# Altium schematic sheet 4th driver.SchDoc
size A3
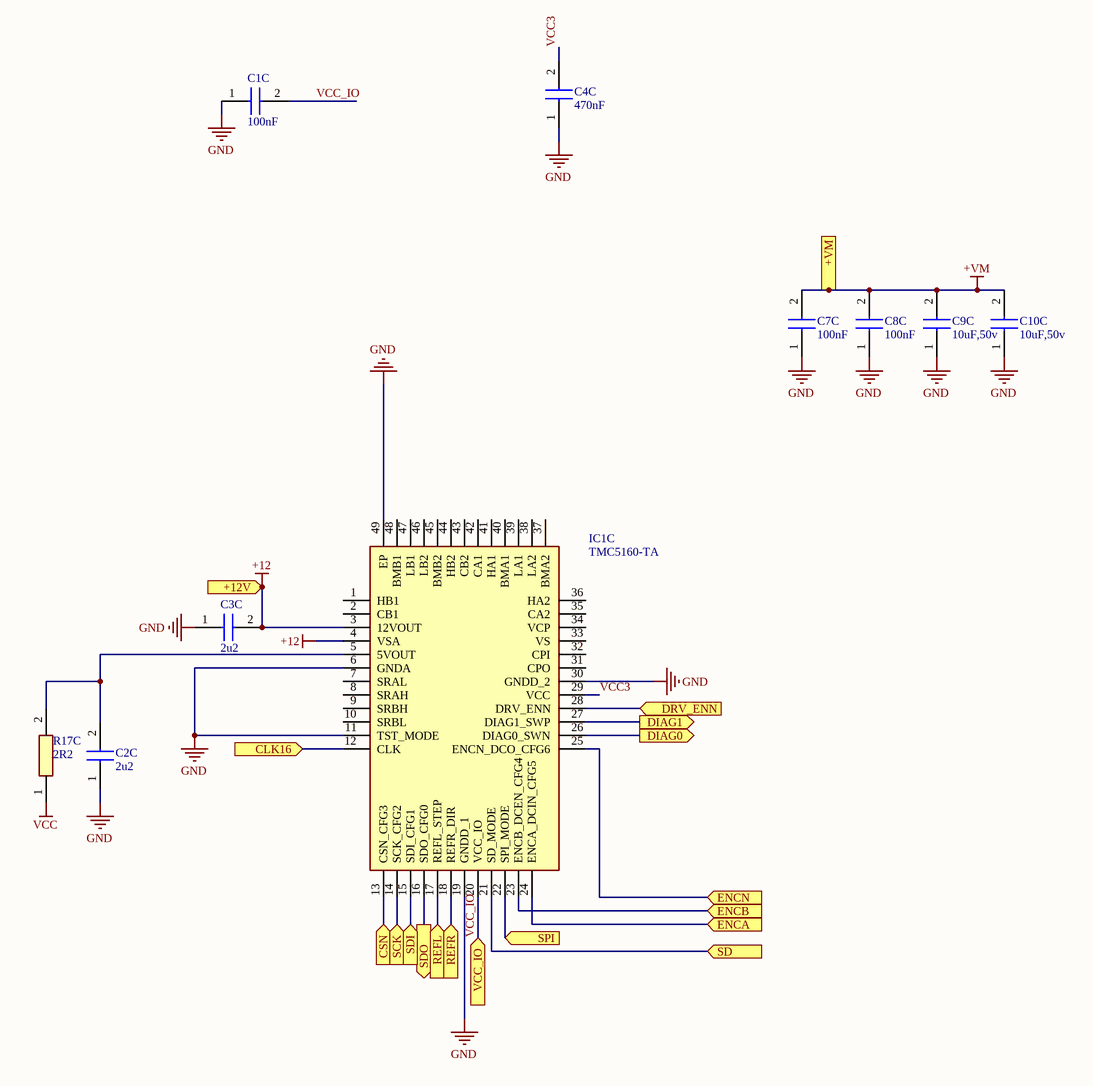
[diagram p0: 4th driver.SchDoc]

## Parts
C1C  100nF  [CAPC1608X90N]
C2C  2u2  [CAPC1608X90N]
C3C  2u2  [CAPC1608X90N]
C4C  470nF  [CAPC1608X90N]
C7C  100nF  [CAPC1608X90N]
C8C  100nF  [CAPC1608X90N]
C9C  10uF,50v  [CAPC3216X180N]
C10C  10uF,50v  [CAPC3216X180N]
IC1C  TMC5160-TA  [QFP50P900X900X120-49N]
R17C  2R2  [RESC1608X55N]

## Ports
+12V (in), +VM (in), CLK16 (in), CSN (in), DIAG0 (out), DIAG1 (out), DRV_ENN (in), ENCA (in), ENCB (in), ENCN (in), REFL (in), REFR (in), SCK (in), SD (in), SDI (in), SDO (out), SPI (in), VCC_IO (in)

## Nets
+12: C3C.2 IC1C.3(12VOUT) IC1C.4(VSA) ; port +12V
+VM: C7C.2 C8C.2 C9C.2 C10C.2 ; port +VM
GND: C1C.1 C2C.1 C3C.1 C4C.1 C7C.1 C8C.1 C9C.1 C10C.1 IC1C.6(GNDA) IC1C.11(TST_MODE) IC1C.19(GNDD_1) IC1C.30(GNDD_2) IC1C.49(EP)
VCC: R17C.1
CLK16: IC1C.12(CLK) ; port CLK16
CSN: IC1C.13(CSN_CFG3) ; port CSN
DIAG0: IC1C.26(DIAG0_SWN) ; port DIAG0
DIAG1: IC1C.27(DIAG1_SWP) ; port DIAG1
DRV_ENN: IC1C.28(DRV_ENN) ; port DRV_ENN
ENCA: IC1C.24(ENCA_DCIN_CFG5) ; port ENCA
ENCB: IC1C.23(ENCB_DCEN_CFG4) ; port ENCB
ENCN: IC1C.25(ENCN_DCO_CFG6) ; port ENCN
REFL: IC1C.17(REFL_STEP) ; port REFL
REFR: IC1C.18(REFR_DIR) ; port REFR
SCK: IC1C.14(SCK_CFG2) ; port SCK
SD: IC1C.21(SD_MODE) ; port SD
SDI: IC1C.15(SDI_CFG1) ; port SDI
SDO: IC1C.16(SDO_CFG0) ; port SDO
SPI: IC1C.22(SPI_MODE) ; port SPI
VCC3: C4C.2 IC1C.29(VCC)
VCC_IO: C1C.2 IC1C.20(VCC_IO) ; port VCC_IO
NetC2C_2: C2C.2 IC1C.5(5VOUT) R17C.2

Not connected (* = marked no-connect by the designer): IC1C 1(HB1) 2(CB1) 7(SRAL) 8(SRAH) 9(SRBH) 10(SRBL) 31(CPO) 32(CPI) 33(VS) 34(VCP) 35(CA2) 36(HA2) 37(BMA2) 38(LA2) 39(LA1) 40(BMA1) 41(HA1) 42(CA1) 43(CB2) 44(HB2) 45(BMB2) 46(LB2) 47(LB1) 48(BMB1)

## Library data of the parts
C1C C2C C3C C4C C7C C8C = GCM188R71H224KA64D: Capacitor; Manufacturer_Name: Murata Electronics; Datasheet Link: https://psearch.en.murata.com/capacitor/product/GCM188R71H224KA64%23.html; Height: 0.9mm; Manufacturer_Part_Number: GCM188R71H224KA64D; Mouser Part Number: 81-GCM188R71H224K64D; Mouser Price/Stock: https://www.mouser.co.uk/ProductDetail/Murata-Electronics/GCM188R71H224KA64D?qs=Kk8YaIHLBVBgtUYYs%2FZrtQ%3D%3D; Arrow Part Number: GCM188R71H224KA64D; Arrow Price/Stock: https://www.arrow.com/en/products/gcm188r71h224ka64d/murata-manufacturing
  C1C C7C C8C: LCSC Part #: C161181
  C2C: LCSC Part #: C77047
  C3C: LCSC Part #: *
  C4C: LCSC Part #: C170149
C9C C10C = GRM31CR61H106MA12L: Capacitor; Manufacturer_Name: Murata Electronics; Datasheet Link: https://datasheet.datasheetarchive.com/originals/distributors/DKDS-10/192395.pdf; Height: 1.8mm; Manufacturer_Part_Number: GRM31CR61H106MA12L; Mouser Part Number: 81-GRM31CR61H106MA2L; Mouser Price/Stock: https://www.mouser.co.uk/ProductDetail/Murata-Electronics/GRM31CR61H106MA12L/?qs=eeBpzGFlv%252B9KISFXBDHybg%3D%3D; Arrow Part Number: GRM31CR61H106MA12L; Arrow Price/Stock: https://www.arrow.com/en/products/grm31cr61h106ma12l/murata-manufacturing?region=europe; LCSC Part #: C882507
IC1C = TMC5160-TA: Integrated Circuit; Manufacturer_Name: TRINAMIC; Datasheet Link: https://datasheet.datasheetarchive.com/originals/distributors/DKDS-40/47761.pdf; Height: 1.2mm; Manufacturer_Part_Number: TMC5160-TA; LCSC Part #: C516354
R17C = MC0063W06031100K: Resistor; Manufacturer_Name: MULTICOMP; Datasheet Link: http://uk.farnell.com/multicomp/mc0063w06031105k/res-thick-film-105k-1-0-063w-0603/dp/1170988; Height: 0.55mm; Manufacturer_Part_Number: MC0063W06031100K; LCSC Part #: C269422